# Altium schematic sheet PenguinPi.SchDoc: PenguinPi v2
size A3; DrawnBy: Steven Bulmer; PageSetup: Record=PageOptions|CenterHorizontal=True|CenterVertical=True|PrintScale=1.01|XCorrection=1.00|YCorrection=1.00|PrintKind=1|BorderSize=5000000|LeftOffset=0|BottomOffset=0|Orientation=2|PaperLength=1000|PaperWidth=1000|Scale=100|PaperSource=7|PrintQuality=600|MediaType=1|DitherType=10|PrintScaleMode=1|PaperKind=A3 (297 x 420mm)|PaperIndex=8
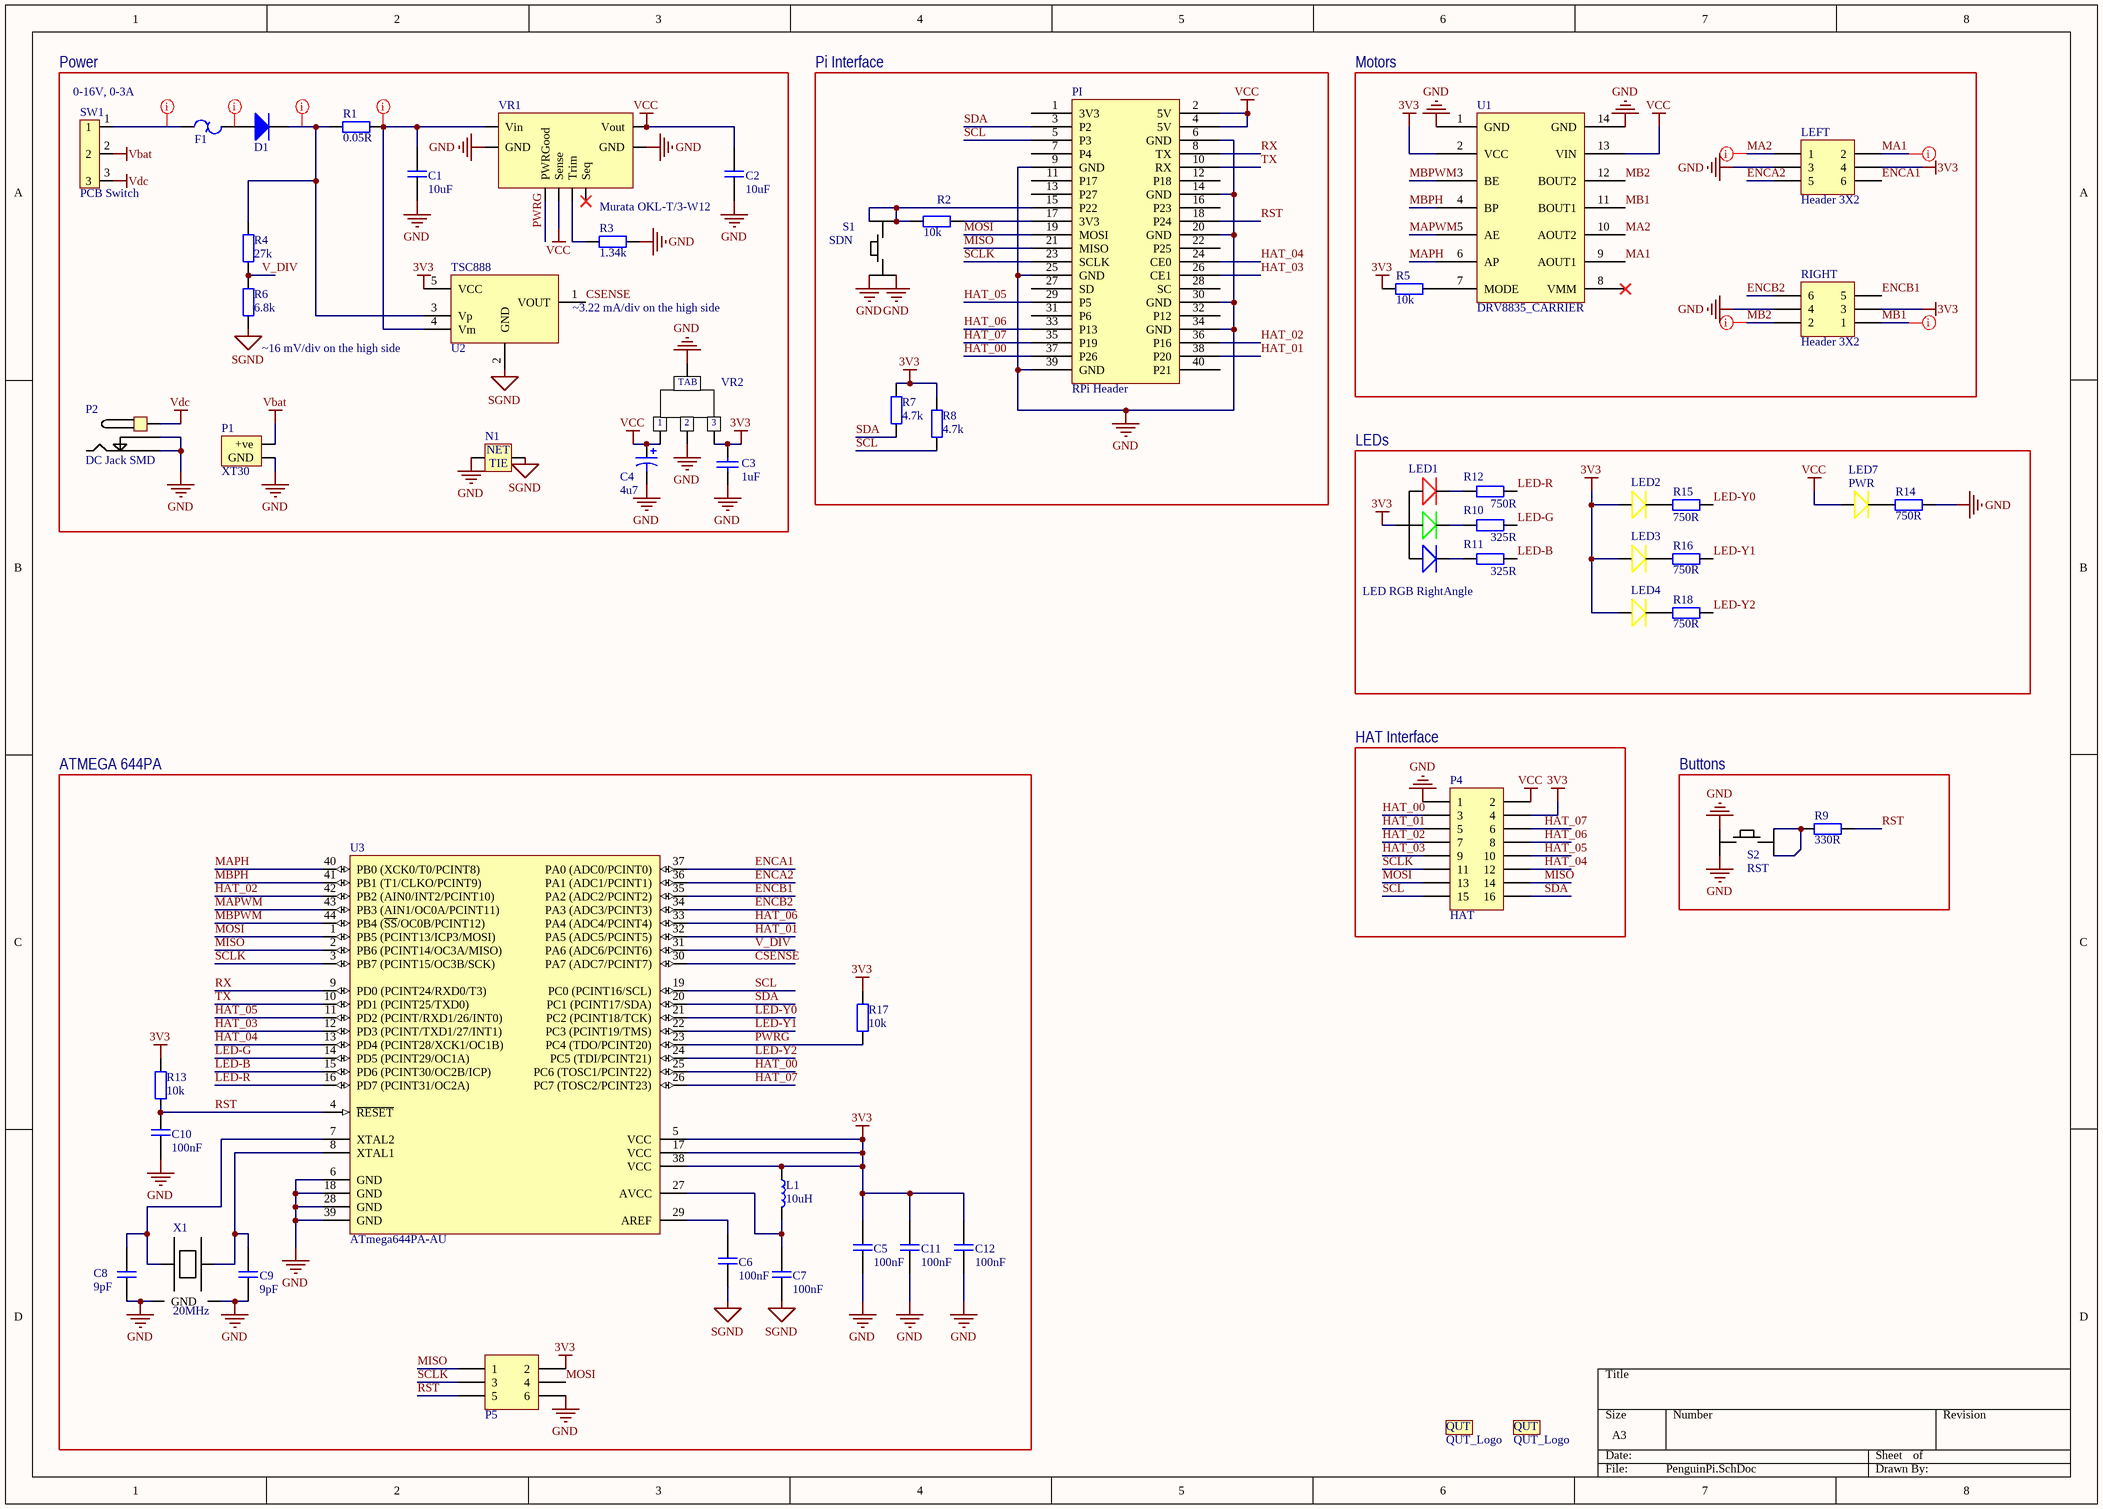
[diagram p0: PenguinPi.SchDoc]

## Parts
C1  value 10uF  [CAPC2012X07N]  (hidden comment: CAP SMD)
C2  value 10uF  [CAPC2012X07N]  (hidden comment: CAP SMD)
C3  value 1uF  [6-0805_M]  (hidden comment: Cap)
C4  value 4u7  [6-0805_M]  (hidden comment: Cap Pol1)
C5  value 100nF  [CAPC2012X07N]  (hidden comment: CAP SMD)
C6  value 100nF  [CAPC2012X07N]  (hidden comment: CAP SMD)
C7  value 100nF  [CAPC2012X07N]  (hidden comment: CAP SMD)
C8  value 9pF  [CAPC2012X07N]  (hidden comment: CAP SMD)
C9  value 9pF  [CAPC2012X07N]  (hidden comment: CAP SMD)
C10  value 100nF  [CAPC2012X07N]  (hidden comment: CAP SMD)
C11  value 100nF  [CAPC2012X07N]  (hidden comment: CAP SMD)
C12  value 100nF  [CAPC2012X07N]  (hidden comment: CAP SMD)
D1  SMD DIODE  [SODFL470X110-2N]  (value not drawn)
F1  RGEF250  [MF-MSMF250/16X-2]  (value not drawn)
L1  value 10uH  [CM322522]  (hidden comment: INDUCTOR SMD)
LED1  LED RGB RightAngle  [LED RGB RightAngle]
LED2  (no value)  [LED YELLOW RightAngle]
LED3  (no value)  [LED YELLOW RightAngle]
LED4  (no value)  [LED YELLOW RightAngle]
LED7  PWR  [LED YELLOW RightAngle]
LEFT  Header 3X2  [HDR2X3]
LG1  QUT_Logo  [QUT_Logo]  (no BOM)
LG2  QUT_Logo  [QUT_Logo]  (no BOM)
N1  NETTIE  [NETTIE-SMD-5mil]  (value not drawn)  (net tie, no BOM)
P1  XT30  [XT30 - PCB mount]
P2  DC Jack SMD  [DC Jack SMD]
P4  HAT  [HDR2X8]
P5  ISP  [Header 3x2 nonstandard]  (value not drawn)
PI  RPi Header  [RPI 2 Header]
R1  value 0.05R  [RESC3216X06M]  (hidden comment: RES SMD)
R2  value 10k  [RESC2012X07N]  (hidden comment: RES SMD)
R3  value 1.34k  [RESC2012X07N]  (hidden comment: RES SMD)
R4  value 27k  [RESC2012X07N]  (hidden comment: RES SMD)
R5  value 10k  [RESC2012X07N]  (hidden comment: RES SMD)
R6  value 6.8k  [RESC2012X07N]  (hidden comment: RES SMD)
R7  value 4.7k  [RESC2012X07N]  (hidden comment: RES SMD)
R8  value 4.7k  [RESC2012X07N]  (hidden comment: RES SMD)
R9  value 330R  [RESC2012X07N]  (hidden comment: RES SMD)
R10  value 325R  [RESC2012X07N]  (hidden comment: RES SMD)
R11  value 325R  [RESC2012X07N]  (hidden comment: RES SMD)
R12  value 750R  [RESC2012X07N]  (hidden comment: RES SMD)
R13  value 10k  [RESC2012X07N]  (hidden comment: RES SMD)
R14  value 750R  [RESC2012X07N]  (hidden comment: RES SMD)
R15  value 750R  [RESC2012X07N]  (hidden comment: RES SMD)
R16  value 750R  [RESC2012X07N]  (hidden comment: RES SMD)
R17  value 10k  [RESC2012X07N]  (hidden comment: RES SMD)
R18  value 750R  [RESC2012X07N]  (hidden comment: RES SMD)
RIGHT  Header 3X2  [HDR2X3]
S1  SDN  [E-SWITCH-TL3342]
S2  RST  [E-SWITCH-TL3342]
SW1  PCB Switch  [PCB Switch]
U1  DRV8835_CARRIER  [DRV8835_CARRIER]
U2  TSC888  [SOT95P280X145-5N]
U3  ATmega644PA-AU  [44A_L]
VR1  Murata OKL-T/3-W12  [OKL-T/3-W12]
VR2  FT_SOT223  [SOT233-4N]  (value not drawn)
X1  20MHz  [XTAL TSX3225]

## Blocks framed on the sheet
Power: C1-C4 D1 F1 N1 P1 P2 R1 R3 R4 R6 SW1 U2 VR1 VR2
Pi Interface: PI R2 R7 R8 S1
Motors: LEFT R5 RIGHT U1
LEDs: LED1-LED4 LED7 R10-R12 R14-R16 R18
ATMEGA 644PA: C5-C12 L1 P5 R13 R17 U3 X1
HAT Interface: P4
Buttons: R9 S2

## Nets
3V3: C3.2 C5.2(K) C11.2(K) C12.2(K) L1.1(Anode) LED1.2(ANODE) LED2.2(ANODE) LED3.2(ANODE) LED4.2(ANODE) LEFT.4 P4.4 P5.2 R5.1 R7.2 R8.2 R13.2 R17.2 RIGHT.3 U1.2(VCC) U2.5(VCC) U3.5(VCC) U3.17(VCC) U3.38(VCC) VR2.3
GND: C1.1(A) C2.1(A) C3.1 C4.2 C5.1(A) C8.1(A) C9.1(A) C10.1(A) C11.1(A) C12.1(A) LEFT.3 N1.1 P1.1(GND) P2.2 P2.3 P4.1 P5.6 PI.6(GND) PI.9(GND) PI.14(GND) PI.20(GND) PI.25(GND) PI.30(GND) PI.34(GND) PI.39(GND) R3.1 R14.2 RIGHT.4 S1.3(B') S1.4(B) S2.1(A) S2.2(A') U1.1(GND) U1.14(GND) U3.6(GND) U3.18(GND) U3.28(GND) U3.39(GND) VR1.3(GND) VR1.7(GND) VR2.2 VR2.4 X1.2(GND) X1.4(GND)
SGND: C6.1(A) C7.1(A) N1.2 R6.1 U2.2(GND)
Vbat: P1.2(+ve) SW1.2
VCC: C2.2(K) C4.1 LED7.2(ANODE) P4.2 PI.2(5V) PI.4(5V) U1.13(VIN) VR1.4(Vout) VR1.5(Sense) VR2.1
Vdc: P2.1 SW1.3
CSENSE: U2.1(VOUT) U3.30(PA7_(ADC7/PCINT7))
ENCA1: LEFT.6 U3.37(PA0_(ADC0/PCINT0))
ENCA2: LEFT.5 U3.36(PA1_(ADC1/PCINT1))
ENCB1: RIGHT.5 U3.35(PA2_(ADC2/PCINT2))
ENCB2: RIGHT.6 U3.34(PA3_(ADC3/PCINT3))
HAT_00: P4.3 PI.37(P26) U3.25(PC6_(TOSC1/PCINT22))
HAT_01: P4.5 PI.38(P20) U3.32(PA5_(ADC5/PCINT5))
HAT_02: P4.7 PI.36(P16) U3.42(PB2_(AIN0/INT2/PCINT10))
HAT_03: P4.9 PI.26(CE1) U3.12(PD3_(PCINT/TXD1/27/INT1))
HAT_04: P4.12 PI.24(CE0) U3.13(PD4_(PCINT28/XCK1/OC1B))
HAT_05: P4.10 PI.29(P5) U3.11(PD2_(PCINT/RXD1/26/INT0))
HAT_06: P4.8 PI.33(P13) U3.33(PA4_(ADC4/PCINT4))
HAT_07: P4.6 PI.35(P19) U3.26(PC7_(TOSC2/PCINT23))
LED-B: R11.2 U3.15(PD6_(PCINT30/OC2B/ICP))
LED-G: R10.2 U3.14(PD5_(PCINT29/OC1A))
LED-R: R12.2 U3.16(PD7_(PCINT31/OC2A))
LED-Y0: R15.2 U3.21(PC2_(PCINT18/TCK))
LED-Y1: R16.2 U3.22(PC3_(PCINT19/TMS))
LED-Y2: R18.2 U3.24(PC5_(TDI/PCINT21))
MA1: LEFT.2 U1.9(AOUT1)
MA2: LEFT.1 U1.10(AOUT2)
MAPH: U1.6(AP) U3.40(PB0_(XCK0/T0/PCINT8))
MAPWM: U1.5(AE) U3.43(PB3_(AIN1/OC0A/PCINT11))
MB1: RIGHT.1 U1.11(BOUT1)
MB2: RIGHT.2 U1.12(BOUT2)
MBPH: U1.4(BP) U3.41(PB1_(T1/CLKO/PCINT9))
MBPWM: U1.3(BE) U3.44(PB4_(~{SS}/OC0B/PCINT12))
MISO: P4.14 P5.1 PI.21(MISO) U3.2(PB6_(PCINT14/OC3A/MISO))
MOSI: P4.13 P5.4 PI.19(MOSI) U3.1(PB5_(PCINT13/ICP3/MOSI))
PWRG: R17.1 U3.23(PC4_(TDO/PCINT20)) VR1.10(PWRGood)
RST: C10.2(K) P5.5 PI.18(P24) R9.2 R13.1 U3.4(~{RESET})
RX: PI.8(TX) U3.9(PD0_(PCINT24/RXD0/T3))
SCL: P4.15 PI.5(P3) R8.1 U3.19(PC0_(PCINT16/SCL))
SCLK: P4.11 P5.3 PI.23(SCLK) U3.3(PB7_(PCINT15/OC3B/SCK))
SDA: P4.16 PI.3(P2) R7.1 U3.20(PC1_(PCINT17/SDA))
TX: PI.10(RX) U3.10(PD1_(PCINT25/TXD0))
V_DIV: R4.1 R6.2 U3.31(PA6_(ADC6/PCINT6))
NetC1_2: C1.2(K) R1.2 U2.4(Vm) VR1.2(Vin)
NetC6_2: C6.2(K) U3.29(AREF)
NetC7_2: C7.2(K) L1.2(Cathode) U3.27(AVCC)
NetC8_2: C8.2(K) U3.7(XTAL2) X1.3
NetC9_2: C9.2(K) U3.8(XTAL1) X1.1
NetD1_1: D1.1 F1.2
NetD1_2: D1.2 R1.1 R4.2 U2.3(Vp)
NetF1_1: F1.1 SW1.1
NetLED1_1: LED1.1(RED) R12.1
NetLED1_3: LED1.3(GREEN) R10.1
NetLED1_4: LED1.4(BLUE) R11.1
NetLED2_1: LED2.1(YELLOW) R15.1
NetLED3_1: LED3.1(YELLOW) R16.1
NetLED4_1: LED4.1(YELLOW) R18.1
NetLED7_1: LED7.1(YELLOW) R14.1
NetPI_15: PI.15(P22) R2.1 S1.1(A) S1.2(A')
NetPI_17: PI.17(3V3) R2.2
NetR3_2: R3.2 VR1.6(Trim)
NetR5_2: R5.2 U1.7(MODE)
NetR9_1: R9.1 S2.3(B') S2.4(B)

Not connected (* = marked no-connect by the designer): PI 1(3V3) 7(P4) 11(P17) 12(P18) 13(P27) 16(P23) 22(P25) 27(SD) 28(SC) 31(P6) 32(P12) 40(P21); U1 8(VMM)*; VR1 9(Seq)*

## Layout directives
net class Power: MA1, MA2, MB1, MB2, NetC1_2, NetD1_1, NetD1_2, NetF1_1

## Notes on the sheet
- (near SW1) 0-16V, 0-3A
- (near U2) ~3.22 mA/div on the high side
- ~16 mV/div on the high side
- (in symbol FT_SOT223) TAB
- (in symbol NETTIE) NET; TIE
- (in symbol QUT_Logo) QUT

## Library data of the parts
C1 C2 C5-C12 = CAP SMD: Surface mount capacitor
C3 = Cap: Capacitor; Published: 8-Jun-2000; LatestRevisionDate: 17-Jul-2002; LatestRevisionNote: Re-released for DXP Platform.; PackageReference: RAD-0.3; Publisher: Altium Limited; PackageDescription: Radial Cap, Thru-Hole; 2 Leads; 0.3 in Pin Spacing
C4 = Cap Pol1: Polarized Capacitor (Radial); Published: 8-Jun-2000; LatestRevisionDate: 17-Jul-2002; LatestRevisionNote: Re-released for DXP Platform.; PackageReference: RB7.6-15; Publisher: Altium Limited; PackageDescription: Polarized Capacitor (Radial); 2 Leads
D1 = SMD DIODE: Surface mount Diode; Supplier: Digikey 1727-5317-1-ND
F1 = RGEF250: PPTC Thermal Fuse; Hold Current: 2.5A; Trip Current: 4.7A; VRating: 16V; Supplier: E14 2519587
L1 = INDUCTOR SMD: Surface Mount Inductor - varying sizes; Supplier: E14 9357866
LED2-LED4 LED7 = LED Yellow RightAngle
LEFT RIGHT = Header 3X2: Header, 3-Pin, Dual row; LatestRevisionDate: 17-Jul-2002; LatestRevisionNote: Re-released for DXP Platform.; Publisher: Altium Limited
P4 = Header 8X2: Header, 8-Pin, Dual row; LatestRevisionDate: 17-Jul-2002; LatestRevisionNote: Re-released for DXP Platform.; Publisher: Altium Limited
P5 = Header 3x2 Staggered: 3 by 2 header, staggered pin arrangement
PI = RPi 2 Header: GPIO connector for Raspberry Pi Microcomputer
R1-R18 = RES SMD: 0805 surface mount resistor
S1 S2 = E-SWITCH-PUSHBUTTON: TL 3342 surface mount pushbutton
  S1: Supplier: Digikey EG2531CT-ND
U1 = DRV8835_CARRIER: DRV8835 Motor Controller
U2 = TSC888: Curent Sense Amplifier
U3 = CMP-0095-00289-2: 8-bit AVR Microcontroller, 64KB Flash, 2KB EEPROM, 4KB SRAM, 44-pin TQFP, Industrial Grade (-40°C to 85°C); PackageVersion: revC, Oct-2010; PackageReference: 44A; ComponentLink2Description: ATmega164A/164PA/324A/324PA/644A/644PA/1284/1284P Datasheet; ComponentLink1URL: http://www.atmel.com/; Code_JEDEC: MS-026-ACB; DatasheetVersion: revC, Jun-2011; PackageDescription: 44-Pin Plastic Thin Profile Quad Flat Pack, 10 x 10 x 1.0 mm Body, 0.8 mm Pitch (TQFP); ComponentLink2URL: http://www.atmel.com/dyn/resources/prod_documents/doc8272.pdf; RevisionNote: DatasheetVersion & PackageVersion updated. Sch pin names updated. URLs added.; ComponentLink1Description: Manufacturer URL; ComponentLink3URL: http://www.atmel.com/dyn/resources/prod_documents/8272S.pdf; ComponentLink3Description: ATmega164A/164PA/324A/324PA/644A/644PA/1284/1284P Summary
X1 = XTAL ABM3B: Supplier: Digikey 535-9125-2-ND
SW1 = PCB Switch: Supplier: Digikey CKN5005-ND